# Altium schematic sheet USB_OTG.SchDoc: STM324x9I-EVAL USB_OTG_HS
size A4; DocumentNumber: 9; Revision: B.3; SheetNumber: 9; SheetTotal: 17
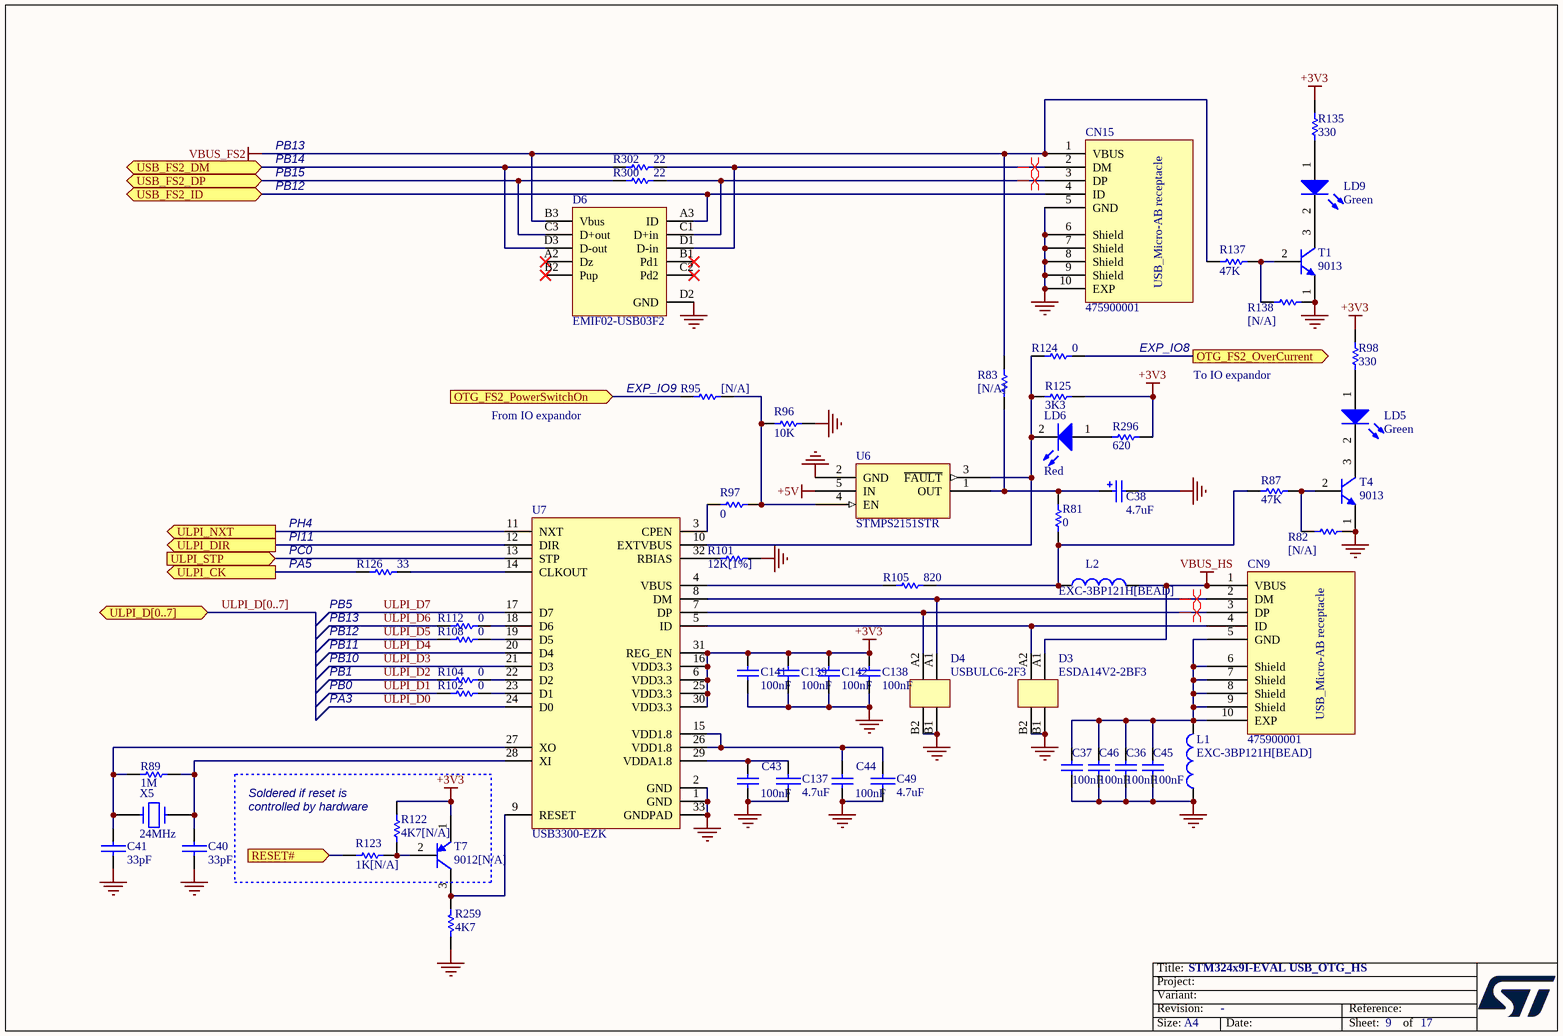
[diagram p0: USB_OTG.SchDoc]

## Parts
C36  100nF  [0603C]
C37  100nF  [0603C]
C38  4.7uF  [TAN-A]
C40  33pF  [0603C]
C41  33pF  [0603C]
C43  100nF  [0603C]
C44  100nF  [0603C]
C45  100nF  [0603C]
C46  100nF  [0603C]
C49  4.7uF  [TAN-A]
C137  4.7uF  [TAN-A]
C138  100nF  [0603C]
C139  100nF  [0603C]
C141  100nF  [0603C]
C142  100nF  [0603C]
CN9  475900001  [MOLEX_47590001]
CN15  475900001  [MOLEX_47590001]
D3  ESDA14V2-2BF3  [BGA4_0R4_0R8X0R8]
D4  USBULC6-2F3  [BGA4_0R4_1X1]
D6  EMIF02-USB03F2  [BGA11_0R5_1R57X2R07]
L1  EXC-3BP121H[BEAD]  [0603L]
L2  EXC-3BP121H[BEAD]  [0603L]
LD5  Green  [0603D]
LD6  Red  [0603D]
LD9  Green  [0603D]
R81  0  [0603R]
R82  [N/A]  [0603R]
R83  [N/A]  [0603R]
R87  47K  [0603R]
R89  1M  [0603R]
R95  [N/A]  [0603R]
R96  10K  [0603R]
R97  0  [0603R]
R98  330  [0603R]
R101  12K[1%]  [0603R]
R102  0  [0603R]
R104  0  [0603R]
R105  820  [0603R]
R108  0  [0603R]
R112  0  [0603R]
R122  4K7[N/A]  [0603R]
R123  1K[N/A]  [0603R]
R124  0  [0603R]
R125  3K3  [0603R]
R126  33  [0603R]
R135  330  [0603R]
R137  47K  [0603R]
R138  [N/A]  [0603R]
R259  4K7  [0603R]
R296  620  [0603R]
R300  22  [0603R]
R302  22  [0603R]
T1  9013  [SOT23-213]
T4  9013  [SOT23-213]
T7  9012[N/A]  [SOT23-213]
U6  STMPS2151STR  [SOT23-5]
U7  USB3300-EZK  [QFN32_0R5_5X5]
X5  24MHz  [XTAL1]

## Ports
OTG_FS2_OverCurrent (out), OTG_FS2_PowerSwitchOn (in), RESET# (in), ULPI_CK (out), ULPI_D[0..7] (bidir), ULPI_DIR (out), ULPI_NXT (out), ULPI_STP (in), USB_FS2_DM (bidir), USB_FS2_DP (bidir), USB_FS2_ID (bidir)

## Nets
+3V3: C138.1 C139.1 C141.1 C142.1 R98.2 R122.1 R125.1 R135.2 R296.2 T7.1(E) U7.6(VDD3.3) U7.16(VDD3.3) U7.25(VDD3.3) U7.30(VDD3.3) U7.31(REG_EN)
+5V: U6.5(IN)
GND: C36.2 C37.2 C38.2 C40.2 C41.2 C43.2 C44.2 C45.2 C46.2 C49.2 C137.2 C138.2 C139.2 C141.2 C142.2 CN15.5(GND) CN15.6(Shield) CN15.7(Shield) CN15.8(Shield) CN15.9(Shield) CN15.10(EXP) D3.B1 D3.B2 D4.B1 D4.B2 D6.D2(GND) L1.1 R82.1 R96.1 R101.1 R138.1 R259.1 T1.1(E) T4.1(E) U6.2(GND) U7.1(GND) U7.2(GND) U7.33(GNDPAD)
VBUS_FS2: CN15.1(VBUS) D6.B3(Vbus) R83.1 R137.1
VBUS_HS: CN9.1(VBUS) D3.A1 L2.2
OTG_FS2_OverCurrent: R124.1 ; port OTG_FS2_OverCurrent
OTG_FS2_PowerSwitchOn: R95.2 ; port OTG_FS2_PowerSwitchOn
RESET#: R123.2 ; port RESET#
ULPI_CK: R126.2 ; port ULPI_CK
ULPI_D0: U7.24(D0)
ULPI_D1: R102.2
ULPI_D2: R104.2
ULPI_D3: U7.21(D3)
ULPI_D4: U7.20(D4)
ULPI_D5: R108.2
ULPI_D6: R112.2
ULPI_D7: U7.17(D7)
ULPI_DIR: U7.12(DIR) ; port ULPI_DIR
ULPI_NXT: U7.11(NXT) ; port ULPI_NXT
ULPI_STP: U7.13(STP) ; port ULPI_STP
USB_FS2_DM: D6.D3(D-out) R302.2 ; port USB_FS2_DM
USB_FS2_DP: D6.C3(D+out) R300.2 ; port USB_FS2_DP
USB_FS2_ID: CN15.4(ID) D6.A3(ID) ; port USB_FS2_ID
NetC36_1: C36.1 C37.1 C45.1 C46.1 CN9.5(GND) CN9.6(Shield) CN9.7(Shield) CN9.8(Shield) CN9.9(Shield) CN9.10(EXP) L1.2
NetC38_1: C38.1 R81.1 R83.2 U6.1(OUT)
NetC40_1: C40.1 R89.2 U7.28(XI) X5.1
NetC41_1: C41.1 R89.1 U7.27(XO) X5.2
NetC43_1: C43.1 C137.1 U7.29(VDDA1.8)
NetC44_1: C44.1 C49.1 U7.15(VDD1.8) U7.26(VDD1.8)
NetCN9_2: CN9.2(DM) D4.A1 U7.8(DM)
NetCN9_3: CN9.3(DP) D4.A2 U7.7(DP)
NetCN9_4: CN9.4(ID) D3.A2 U7.5(ID)
NetCN15_2: CN15.2(DM) D6.D1(D-in) R302.1
NetCN15_3: CN15.3(DP) D6.C1(D+in) R300.1
NetL2_1: L2.1 R81.2 R87.2 R105.2
NetLD5_1: LD5.1(A) R98.1
NetLD5_2: LD5.2(K) T4.3(C)
NetLD6_1: LD6.1(A) R296.1
NetLD6_2: LD6.2(K) R124.2 R125.2 U6.3(~{FAULT}) U7.10(EXTVBUS)
NetLD9_1: LD9.1(A) R135.1
NetLD9_2: LD9.2(K) T1.3(C)
NetR82_2: R82.2 R87.1 T4.2(B)
NetR95_1: R95.1 R96.2 R97.2 U6.4(EN)
NetR97_1: R97.1 U7.3(CPEN)
NetR101_2: R101.2 U7.32(RBIAS)
NetR102_1: R102.1 U7.23(D1)
NetR104_1: R104.1 U7.22(D2)
NetR105_1: R105.1 U7.4(VBUS)
NetR108_1: R108.1 U7.19(D5)
NetR112_1: R112.1 U7.18(D6)
NetR122_2: R122.2 R123.1 T7.2(B)
NetR126_1: R126.1 U7.14(CLKOUT)
NetR137_2: R137.2 R138.2 T1.2(B)
NetR259_2: R259.2 T7.3(C) U7.9(RESET)

Not connected (* = marked no-connect by the designer): D6 A2(Dz)* B1(Pd1)* B2(Pup)* C2(Pd2)*

## Buses and harness runs
bus ULPI_D[0..7] = port ULPI_D[0..7]

## Layout directives
differential pair: NetCN9_2, NetCN9_3, NetCN15_2, NetCN15_3

## Notes on the sheet
- PB13
- PB14
- PB15
- PB12
- EXP_IO8
- To IO expandor
- From IO expandor
- (near R95) EXP_IO9
- PH4
- PI11
- PC0
- PA5
- PB11
- (near R126) PB13
- (near R126) PB5
- PA3
- PB0
- PB1
- PB10
- (near R122) Soldered if reset is
- (near R122) controlled by hardware
- Title:
- Project:
- Size:
- Revision:
- Variant:
- A4
- -
- Date:
- Reference:
- Sheet:
- of
- (in symbol 475900001) USB_Micro-AB receptacle

## Library data of the parts
C36 C37 C43-C46 C138 C139 C141 C142 = Cap: Capacitor; Value: 10nF; Published: 8-Jun-2000; Revision: July-2002: Re-released for DXP Platform.; Publisher: Altium Limited
C38 = Cap Pol1: Polarized Capacitor (Radial); Value: 47uF; Published: 8-Jun-2000; Revision: July-2002: Re-released for DXP Platform.; Publisher: Altium Limited
C40 C41 C49 C137 = CAP: Capacitor
L1 L2 = Inductor: Value: 100uH; Published: 8-Jun-2000; Revision: July-2002: Re-released for DXP Platform.; Publisher: Altium Limited
LD5 LD6 LD9 = LED2: Typical RED, GREEN, YELLOW, AMBER GaAs LED; Published: 8-Jun-2000; Revision: July-2002: Re-released for DXP Platform.; Publisher: Altium Limited
R81 R83 R89 R95 R97 R101 R102 R104 R108 R112 R122-R124 R126 R259 R296 R300 R302 = Res1: Resistor; Value: 1K; Published: 8-Jun-2000; Revision: July-2002: Re-released for DXP Platform.; Publisher: Altium Limited
R82 R87 R96 R98 R105 R125 R135 R137 R138 = res1: Resistor; Value: 1K; Published: 8-Jun-2000; Revision: July-2002: Re-released for DXP Platform.; Publisher: Altium Limited
T1 T4 = NPN: NPN Bipolar Transistor; Code - JEDEC: TO-226-AA; Published: 8-Jun-2000; Revision: July-2002: Re-released for DXP Platform.; Publisher: Altium Limited
T7 = PNP: PNP Bipolar Transistor; Code - JEDEC: SOT-23; Published: 8-Jun-2000; Revision: July-2002: Re-released for DXP Platform.; Publisher: Altium Limited
U6 = STMPS2141STR
X5 = CRYSTAL